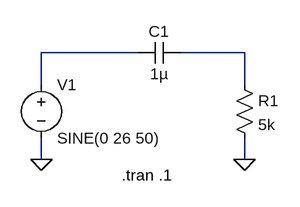
[diagram p0: schematic CA+Condo-2.asc]
CA+Condo-2.asc, the LTspice schematic file:
Version 4
SHEET 1 880 680
WIRE 176 112 32 112
WIRE 336 112 240 112
WIRE 32 160 32 112
WIRE 336 160 336 112
WIRE 32 272 32 240
WIRE 336 272 336 240
FLAG 32 272 0
FLAG 336 272 0
SYMBOL voltage 32 144 R0
WINDOW 123 0 0 Left 0
WINDOW 39 0 0 Left 0
SYMATTR InstName V1
SYMATTR Value SINE(0 26 50)
SYMBOL cap 240 96 R90
WINDOW 0 0 32 VBottom 2
WINDOW 3 32 32 VTop 2
SYMATTR InstName C1
SYMATTR Value 1µ
SYMBOL res 320 144 R0
SYMATTR InstName R1
SYMATTR Value 5k
TEXT 152 296 Left 2 !.tran .1

The netlist it stands for:
* CA+Condo-2.asc
V1 N001 0 SINE(0 26 50)
C1 N002 N001 1µ
R1 N002 0 5k
.tran .1
.backanno
.end